# Altium schematic sheet S2C_IOs1V8.SchDoc
size A4; SheetNumber: 14
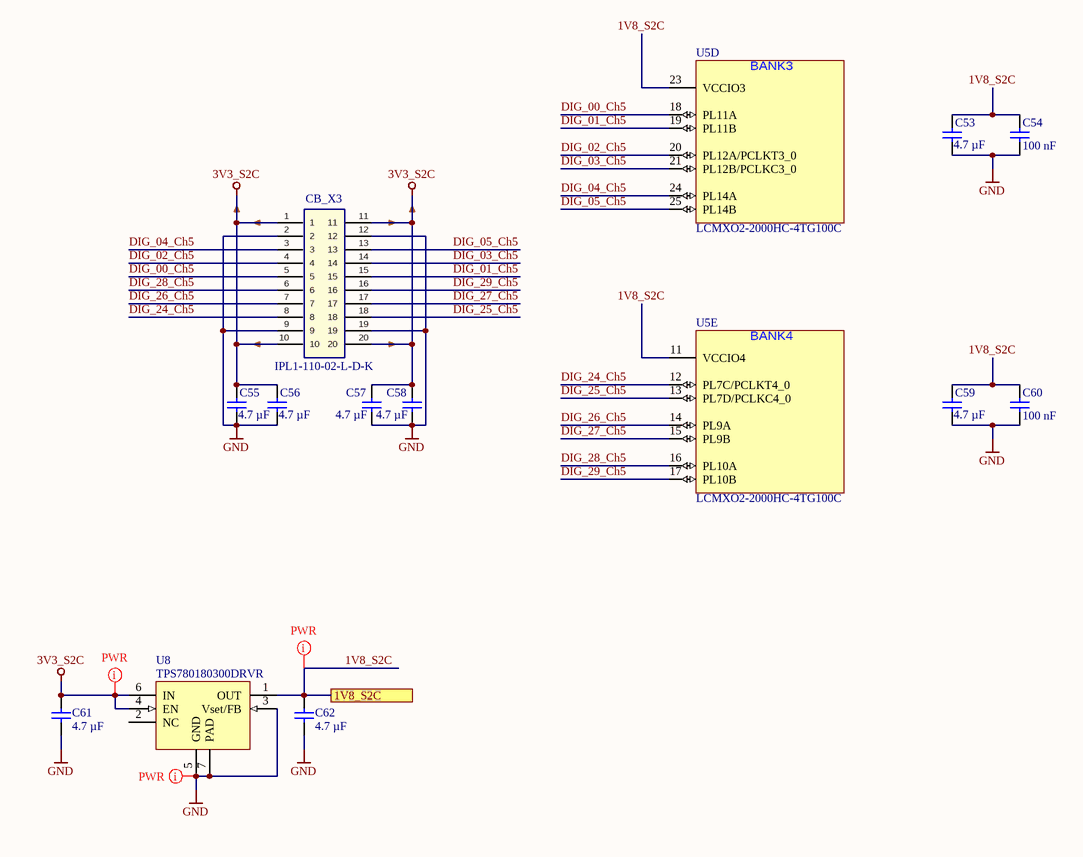
[diagram p0: S2C_IOs1V8.SchDoc]

## Parts
C53  4.7 µF  [C_0603_TE]
C54  100 nF  [C_0603_TE]
C55  4.7 µF  [C_0603_TE]
C56  4.7 µF  [C_0603_TE]
C57  4.7 µF  [C_0603_TE]
C58  4.7 µF  [C_0603_TE]
C59  4.7 µF  [C_0603_TE]
C60  100 nF  [C_0603_TE]
C61  4.7 µF  [C_0603_TE]
C62  4.7 µF  [C_0603_TE]
CB_X3  IPL1-110-02-L-D-K  [IPL1-110-02-L-D-K]
U5  LCMXO2-2000HC-4TG100C  [QFP50P1600X1600X160-100N]  (parts D,E of 7)
U8  TPS780180300DRVR  [SON65P200X200X80-7N]

## Ports
1V8_S2C

## Nets
3V3_S2C: C55.1 C56.1 C57.1 C58.1 C61.2 CB_X3.1 CB_X3.10 CB_X3.11 CB_X3.20 U8.4(EN) U8.6(IN)
GND: C53.2 C54.1 C55.2 C56.2 C57.2 C58.2 C59.2 C60.1 C61.1 C62.1 CB_X3.2 CB_X3.9 CB_X3.12 CB_X3.19 U8.3(Vset/FB) U8.5(GND) U8.7(PAD)
1V8_S2C: C53.1 C54.2 C59.1 C60.2 C62.2 U5.11(VCCIO4) U5.23(VCCIO3) U8.1(OUT) ; port 1V8_S2C
DIG_00_Ch5: CB_X3.5 U5.18(PL11A)
DIG_01_Ch5: CB_X3.15 U5.19(PL11B)
DIG_02_Ch5: CB_X3.4 U5.20(PL12A/PCLKT3_0)
DIG_03_Ch5: CB_X3.14 U5.21(PL12B/PCLKC3_0)
DIG_04_Ch5: CB_X3.3 U5.24(PL14A)
DIG_05_Ch5: CB_X3.13 U5.25(PL14B)
DIG_24_Ch5: CB_X3.8 U5.12(PL7C/PCLKT4_0)
DIG_25_Ch5: CB_X3.18 U5.13(PL7D/PCLKC4_0)
DIG_26_Ch5: CB_X3.7 U5.14(PL9A)
DIG_27_Ch5: CB_X3.17 U5.15(PL9B)
DIG_28_Ch5: CB_X3.6 U5.16(PL10A)
DIG_29_Ch5: CB_X3.16 U5.17(PL10B)

Not connected (* = marked no-connect by the designer): U8 2(NC)

## Layout directives
net class PWR: 1V8_S2C, 3V3_S2C, GND

## Notes on the sheet
- Title
- Revision:
- Design Engineer:
- Date:
- Project:
- Sheet
- of
- (in symbol LCMXO2-2000HC-4TG100C, part D) BANK3
- (in symbol LCMXO2-2000HC-4TG100C, part E) BANK4

## Library data of the parts
C53 C55-C59 C61 C62 = UZgen_C_0603_4.7uF_16V_X5R: Generic capacitor; Manufacturer: UZgen; Voltage: 16V; Tolerance: 10 %; Created from: MGeier; Manufacturer Part Number: UZgen_C_0603_4.7uF_16V_X5R; PartID: 5809; Created On: 20/03/2025 14:43:45; Value: 4.7 µF; Device Package: 0603; Technology: X5R; Mounting Type: SMD; Last Updated: 20/03/2025 14:43:45
C54 C60 = UZgen_C_0603_100nF_50V_X7R: Generic capacitor; Manufacturer: UZgen; Tolerance: 10 %; Voltage: 50 V; Created from: AGeiger; Value: 100 nF; Technology: X7R; Manufacturer Part Number: UZgen_C_0603_100nF_50V_X7R; PartID: 1; Created On: 02/07/2024 14:42:23; Device Package: 0603; Mounting Type: SMD; Last Updated: 02/08/2024 14:45:57
CB_X3 = IPL1-110-02-L-D-K: 2.54 mm Double Row Termin Assembly (SMD); Manufacturer: SAMTEC; Created from: MGremer; Number of positions: 10; Manufacturer Part Number: IPL1-110-02-L-D-K; PartID: 21; Created On: 30/11/2020 10:38:50; ComponentLink1Description: Homepage; ComponentLink1URL: https://www.samtec.com/products/ipl1; Component Type: Samtec Connector; Device Package: Connector; Last Updated: 01/04/2025 14:15:00; Mounting Type: THT; Supplier 1: SAMTEC; Supplier Part Number 1: IPL1-110-02-L-D-K; Supplier 2: Digi-Key; Supplier Part Number 2: SAM10586-ND; Supplier 3: LCSC; Supplier Part Number 3: C7544188; Type: Connector; Live Cycle Status: 1; Number of rows: 2; Stock number: not stored; LCSC Part Number: C7544188
U5 = LCMXO2-2000HC-4TG100C: TQFP-100(14x14) Programmable Logic Device (CPLDs/FPGAs) ROHS; Manufacturer: Lattice; Created from: FRosner; Manufacturer Part Number: LCMXO2-2000HC-4TG100C; PartID: 37; Created On: 03/07/2024 17:33:36; ComponentLink1Description: Datasheet; ComponentLink1URL: https://wmsc.lcsc.com/wmsc/upload/file/pdf/v2/lcsc/2403111456_Lattice-LCMXO2-2000HC-4TG100C_C1521632.pdf; Component Type: CPLD; Device Package: TQFP-100; Last Updated: 23/08/2024 11:42:29; Mounting Type: SMD; Operating Temperature: -0 to +85 °C; Supplier 1: LCSC; Supplier Part Number 1: C1521632; Supplier 2: Mouser; Supplier Part Number 2: 842-XO22000HC4TG100C; Type: CPLD; Live Cycle Status: 1; LCSC Part Number: C1521632; Stock number: not stored
U8 = TPS780180300DRVR: LDO Voltage Regulators 150mA,LDO Reg,Ultra Low Pwr; Manufacturer: Texas Instruments; Value: 1.8 V, 3 V; Created from: FRosner; Manufacturer Part Number: TPS780180300DRVR; PartID: 17; Created On: 02/07/2024 16:16:00; ComponentLink1Description: Datasheet; ComponentLink1URL: https://wmsc.lcsc.com/wmsc/upload/file/pdf/v2/lcsc/2302220830_Texas-Instruments-TPS780180300DRVR_C2860011.pdf; Component Type: LDO; Device Package: SMD; Last Updated: 03/09/2024 16:21:15; Mounting Type: SMD; Operating Temperature: -40 to +125 °C; Series: TPS780; Supplier 1: Mouser; Supplier Part Number 1: 595-TPS780180300DRVR; Supplier 2: LCSC; Supplier Part Number 2: C2860011; Type: LDO; Live Cycle Status: 1; LCSC Part Number: C2860011; Stock number: not stored